# EAGLE design zero (EAGLE 5.07)
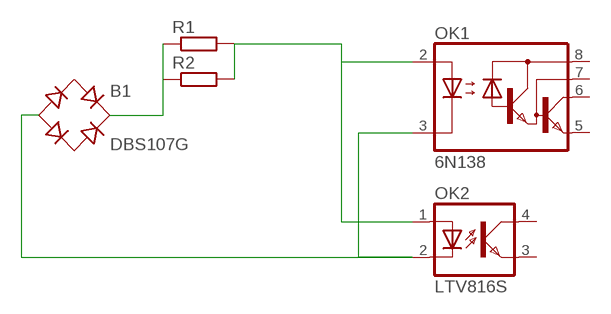
[diagram p0: schematic, sheet 1]

## Parts
B1  DBS107G  [DBS]
OK1  6N138  [DIL08]
OK2  LTV816S  [SMD4]
R1  R-EU_R2512  [R2512]
R2  R-EU_M3516  [M3516]

## Nets
N$1: B1.+ R1.1 R2.1
N$2: B1.- OK1.3(C) OK2.2(C)
N$3: OK1.2(A) OK2.1(A) R1.2 R2.2
Unconnected: B1.AC1 B1.AC2 OK1.5(GND) OK1.6(VO) OK1.7(VB) OK1.8(VCC) OK2.3(EMIT) OK2.4(COL)

## Library data of the parts
B1 = rectifier:DB?*G: Single Phase 1.0 AMP Glass Passivated Bridge Rectifier Taiwan Semiconductor Co.,Ltd. - TSC Source: http://www.taiwansemi.com/TSCbig5/ezcatfiles/cust/img/img/db101g.pdf http://www.ts.com.tw/db/pictures/modules/PDT/PDT060207001/DBLS201G.pdf
OK1 = optocoupler:6N138: MOTOROLA OPTO COUPLER
OK2 = optocoupler:LTV816: OPTO COUPLER Source: LITEON, LTV816.pdf
R1 R2 = resistor:R-EU_: RESISTOR, European symbol

## Board
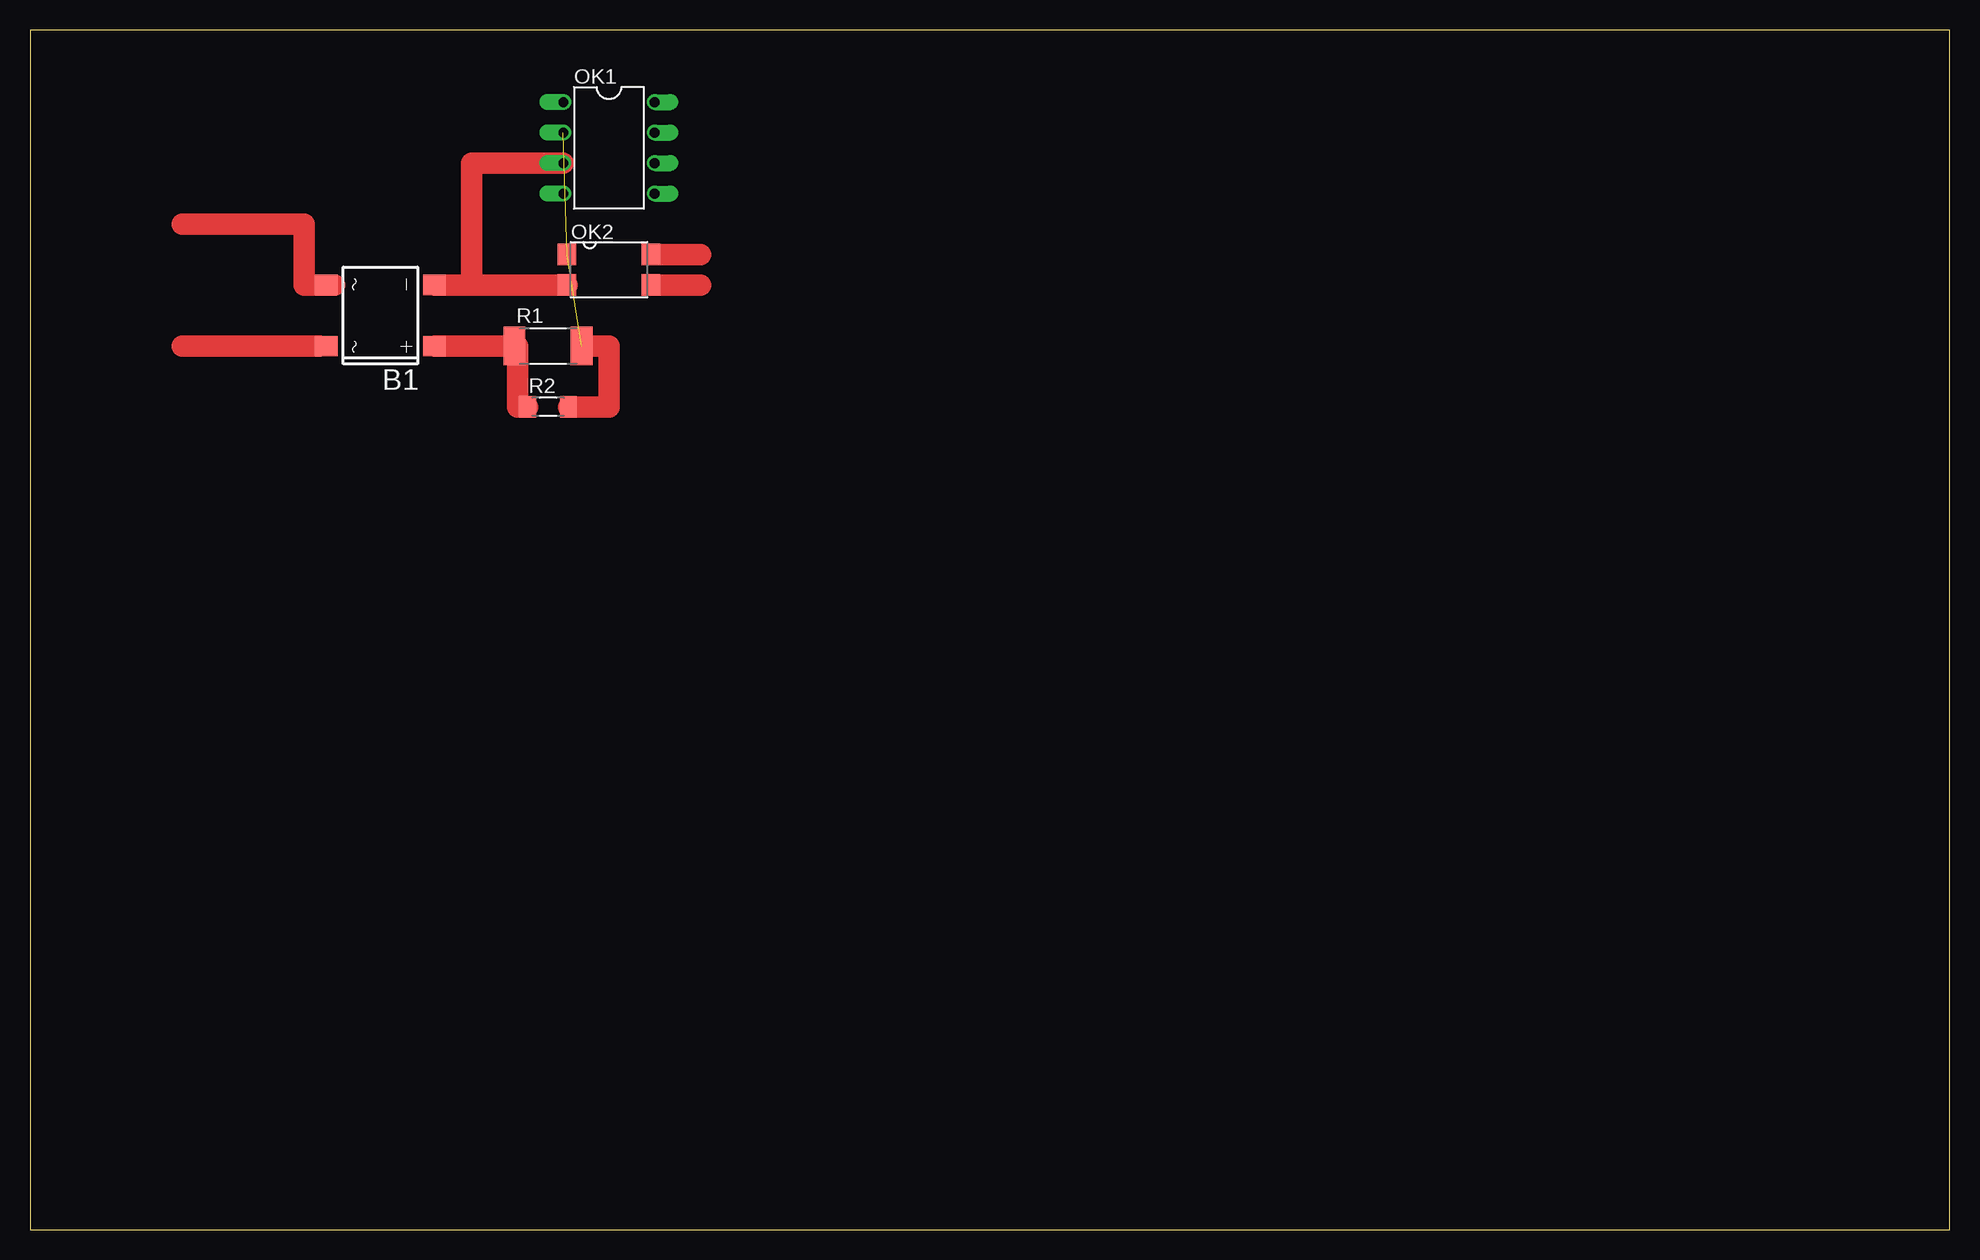
[diagram p1: board, top side]

Size 160 x 100 mm. Coordinates in mm from the lower left corner, seen from the top.
Outline: 0,0 160,0 160,100 0,100 0,0
Copper layers (1*16): Top 0.035mm / dielectric 1.5mm / Bottom 0.035mm
Design rules "default": minimum track width 10mil, minimum drill 24mil, track to track 8mil, track to pad 8mil, pad to pad 8mil, via to via 8mil, smd to smd 8mil, copper to edge 40mil, drill to drill 8mil, minimum pad ring 10mil, minimum via ring 8mil, stop-mask expansion 4mil, vias tented up to drill 0mil, thermal gap 10mil

### Footprints (pad centres in the part's own frame; a part is rotated, then mirrored left to right if it is on the bottom)
DBS = smd 1.7 x 1.9: + -2.55,-4.5; - 2.55,-4.5; AC1 -2.55,4.5; AC2 2.55,4.5
DIL08 = drill 0.813 offset: 1 -3.81,-3.81; 2 -1.27,-3.81; 3 1.27,-3.81; 4 3.81,-3.81; 5 3.81,3.81; 6 1.27,3.81; 7 -1.27,3.81; 8 -3.81,3.81
SMD4 = smd 1.78 x 1.55: 1 -1.27,-3.5; 2 1.27,-3.5; 3 1.27,3.5; 4 -1.27,3.5
R2512 = smd 1.8 x 3.2: 1 -2.8,0; 2 2.8,0
M3516 = smd 1.4 x 1.8: 1 -1.7,0; 2 1.7,0

### Placement (x,y rotation side)
B1  29.21,76.2 90 top
OK1  48.26,90.17 270 top
OK2  48.26,80.01 270 top
R1  43.18,73.66 0 top
R2  43.18,68.58 0 top

### Tracks (layer width: path | path; a pad name or v marks a point on that pad's centre or on a via)
N$1
  Top 1.778: B1.+ R1.1 40.64,73.66 40.64,68.58 R2.1
N$2
  Top 1.778: OK1.3 36.83,88.9 36.83,78.75 B1.- OK2.2
N$3  (2 unrouted)
  Top 1.778: R2.2 48.26,68.58 48.26,73.66 R1.2
N$4
  Top 1.778: 25.4,78.74 22.86,78.74 22.86,83.82 12.7,83.82
N$5
  Top 1.778: 24.13,73.66 12.7,73.66
N$6
  Top 1.778: 52.07,78.74 55.88,78.74
N$7
  Top 1.778: 52.07,81.28 55.88,81.28